# Altium schematic sheet 2019_PROPEEPROM.SchDoc
size A4
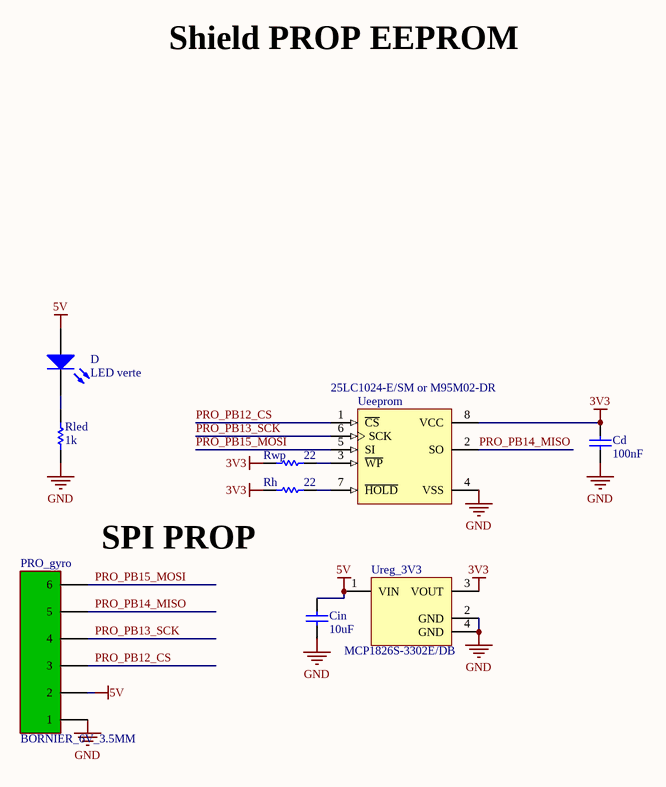
[diagram p0: 2019_PROPEEPROM.SchDoc]

## Parts
Cd  100nF  [C0805_N]
Cin  10uF  [C1206_N]
D  LED verte  [LED_0805]
PRO_gyro  BORNIER_6V_3.5MM  [BORNIER_6V_3.5MM]
Rh  22  [R1206_N]
Rled  1k  [R1206_N]
Rwp  22  [R1206_N]
Ueeprom  25LC1024-E/SM or M95M02-DR  [SOIJ-SM8_N]
Ureg_3V3  MCP1826S-3302E/DB  [SOT223-4N]

## Nets
3V3: Cd.2 Rh.2 Rwp.2 Ueeprom.8(VCC) Ureg_3V3.3(VOUT)
5V: Cin.2 D.1(A) PRO_gyro.2 Ureg_3V3.1(VIN)
GND: Cd.1 Cin.1 PRO_gyro.1 Rled.1 Ueeprom.4(VSS) Ureg_3V3.2(GND) Ureg_3V3.4(GND)
PRO_PB12_CS: PRO_gyro.3 Ueeprom.1(~{CS})
PRO_PB13_SCK: PRO_gyro.4 Ueeprom.6(SCK)
PRO_PB14_MISO: PRO_gyro.5 Ueeprom.2(SO)
PRO_PB15_MOSI: PRO_gyro.6 Ueeprom.5(SI)
NetD_2: D.2(K) Rled.2
NetRh_1: Rh.1 Ueeprom.7(~{HOLD})
NetRwp_1: Rwp.1 Ueeprom.3(~{WP})

## Notes on the sheet
- Shield PROP EEPROM
- SPI PROP
- Title
- Size:
- Date:
- A4
- Number:
- Time:
- Revision:
- Sheet
- of
- File:

## Library data of the parts
Cd = Condensateur: Capacitor; Published: 8-Jun-2000; LatestRevisionDate: 17-Jul-2002; LatestRevisionNote: Re-released for DXP Platform.; PackageReference: RAD-0.3; Publisher: Altium Limited
Cin = Capacitor: Published: 8-Jun-2000; LatestRevisionDate: 17-Jul-2002; LatestRevisionNote: Re-released for DXP Platform.; PackageReference: RAD-0.3; Publisher: Altium Limited
D = LED: Typical LED; Published: 8-Jun-2000; LatestRevisionDate: 08-Jul-2005; LatestRevisionNote: Mech Layer 1 removed.; PackageReference: LED-1; Publisher: Altium Limited
Rh Rled Rwp = Resistor: Published: 8-Jun-2000; LatestRevisionDate: 17-Jul-2002; LatestRevisionNote: Re-released for DXP Platform.; PackageReference: AXIAL-0.5; Publisher: Altium Limited
Ueeprom = 25LC1024-E/SM: 1 Mbit SPI Bus Serial EEPROM, 8-Pin SOIC, Extended Temperature; Manufacturer: Microchip; DatasheetVersion: revC, Oct-2008; PackageVersion: revBB, Aug-2009; PackageReference: SOIJ-SM8; PackageDescription: 8-Lead Plastic Small Outline (SM) - Medium, 5.28 mm Body [SOIJ]; Supplier 1: Digi-Key; Supplier Part Number 1: 25LC1024-E/SM-ND; Supplier 2: Farnell; Supplier Part Number 2: 2098001; Supplier 3: Newark; Supplier Part Number 3: 89H3174; Supplier 4: Mouser; Supplier Part Number 4: 579-25LC1024-E/SM; Mounting Technology: Surface Mount; PartNumber: 25LC1024-E/SM; ComponentLink1Description: Manufacturer URL; ComponentLink1URL: http://www.microchip.com/; ComponentLink2Description: Datasheet; ComponentLink2URL: http://ww1.microchip.com/downloads/en/DeviceDoc/22064C.pdf; ComponentLink3Description: Package Specification; ComponentLink3URL: http://www.microchip.com/stellent/groups/techpub_sg/documents/packagingspec/en012702.pdf
Ureg_3V3 = MCP1826S-3302E/DB: 1000 mA, Low Voltage, Low Quiescent Current LDO Regulator, 3-Pin SOT-223, Extended Temperature; FirstPublished: 29-Jan-2009; DatasheetVersion: revA, Aug-2007; PackageVersion: revBB, Aug-2009; PackageReference: SOT-223-DB3; Publisher: Altium Limited; PackageDescription: 3-Lead Plastic Small Outline Transistor (DB) [SOT-223]; Supplier 1: Digi-Key; Supplier Part Number 1: MCP1826S-3302E/DB-ND; Supplier 2: Farnell; Supplier Part Number 2: 1578424; Supplier 3: Newark; Supplier Part Number 3: 27M0037; ComponentLink1Description: Datasheet; ComponentLink1URL: http://ww1.microchip.com/downloads/en/DeviceDoc/22057a.pdf; ComponentLink2Description: Packaging Specification; ComponentLink2URL: http://www.microchip.com/stellent/groups/techpub_sg/documents/packagingspec/en012702.pdf; ComponentLink3Description: Microchip.com Home; ComponentLink3URL: http://www.microchip.com/